# EAGLE design RHD2132_lvds_headstage_3_1_smaller_01 (EAGLE 6.3)
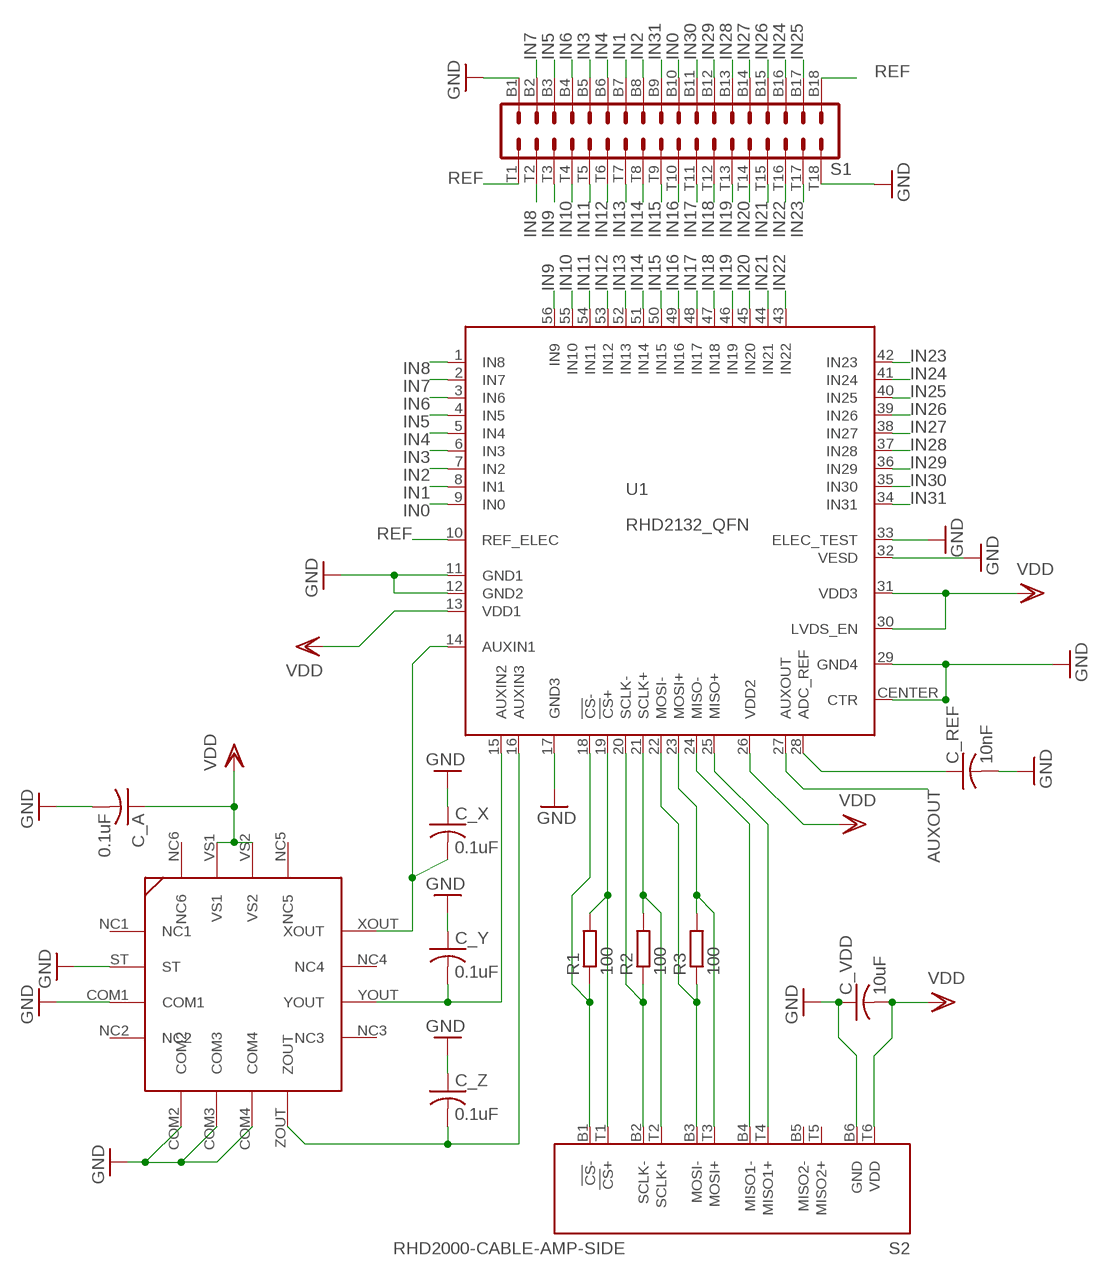
[diagram p0: schematic, sheet 1]

## Parts
C_A  0.1uF  C-USC0402K  [C0402K]
C_REF  10nF  C-USC0402K  [C0402K]
C_VDD  10uF  C-USC0402K  [C0402K]
C_X  0.1uF  C-USC0402K  [C0402K]
C_Y  0.1uF  C-USC0402K  [C0402K]
C_Z  0.1uF  C-USC0402K  [C0402K]
R1  100  R-EU_R0402  [R0402]
R2  100  R-EU_R0402  [R0402]
R3  100  R-EU_R0402  [R0402]
S1  OMNETICS_A79025  [OMNETICS_A79025]
S2  RHD2000-CABLE-AMP-SIDE  [OMNETICS_PZN-12-AA]
U1  RHD2132_QFN  [QFN56_8_X_8_LARGE]
U$1  ADXL335  [ADXL335]

## Nets
ADC_REF: C_REF.1 U1.28(ADC_REF)
AUXOUT: U1.27(AUXOUT)
CS+: R1.2 S2.T1(!CS!+) U1.19(!CS!+)
CS-: R1.1 S2.B1(!CS!-) U1.18(!CS!-)
GND: C_A.2 C_REF.2 C_VDD.1 C_X.1 C_Y.1 C_Z.1 S1.B1 S1.T18 S2.B6(GND) U1.11(GND1) U1.12(GND2) U1.17(GND3) U1.29(GND4) U1.32(VESD) U1.33(ELEC_TEST) U1.CENTER(CTR) U$1.COM1 U$1.COM2 U$1.COM3 U$1.COM4 U$1.ST
IN0: S1.B10 U1.9(IN0)
IN1: S1.B7 U1.8(IN1)
IN2: S1.B8 U1.7(IN2)
IN3: S1.B5 U1.6(IN3)
IN4: S1.B6 U1.5(IN4)
IN5: S1.B3 U1.4(IN5)
IN6: S1.B4 U1.3(IN6)
IN7: S1.B2 U1.2(IN7)
IN8: S1.T2 U1.1(IN8)
IN9: S1.T3 U1.56(IN9)
IN10: S1.T4 U1.55(IN10)
IN11: S1.T5 U1.54(IN11)
IN12: S1.T6 U1.53(IN12)
IN13: S1.T7 U1.52(IN13)
IN14: S1.T8 U1.51(IN14)
IN15: S1.T9 U1.50(IN15)
IN16: S1.T10 U1.49(IN16)
IN17: S1.T11 U1.48(IN17)
IN18: S1.T12 U1.47(IN18)
IN19: S1.T13 U1.46(IN19)
IN20: S1.T14 U1.45(IN20)
IN21: S1.T15 U1.44(IN21)
IN22: S1.T16 U1.43(IN22)
IN23: S1.T17 U1.42(IN23)
IN24: S1.B16 U1.41(IN24)
IN25: S1.B17 U1.40(IN25)
IN26: S1.B15 U1.39(IN26)
IN27: S1.B14 U1.38(IN27)
IN28: S1.B13 U1.37(IN28)
IN29: S1.B12 U1.36(IN29)
IN30: S1.B11 U1.35(IN30)
IN31: S1.B9 U1.34(IN31)
MISO1+: S2.T4(MISO1+) U1.25(MISO+)
MISO1-: S2.B4(MISO1-) U1.24(MISO-)
MOSI+: R3.2 S2.T3(MOSI+) U1.23(MOSI+)
MOSI-: R3.1 S2.B3(MOSI-) U1.22(MOSI-)
REF: S1.B18 S1.T1 U1.10(REF_ELEC)
SCLK+: R2.2 S2.T2(SCLK+) U1.21(SCLK+)
SCLK-: R2.1 S2.B2(SCLK-) U1.20(SCLK-)
VDD: C_A.1 C_VDD.2 S2.T6(VDD) U1.13(VDD1) U1.26(VDD2) U1.30(LVDS_EN) U1.31(VDD3) U$1.VS1 U$1.VS2
XOUT: C_X.2 U1.14(AUXIN1) U$1.XOUT
YOUT: C_Y.2 U1.15(AUXIN2) U$1.YOUT
ZOUT: C_Z.2 U1.16(AUXIN3) U$1.ZOUT
Unconnected: S2.B5(MISO2-) S2.T5(MISO2+) U$1.NC1 U$1.NC2 U$1.NC3 U$1.NC4 U$1.NC5 U$1.NC6

## Library data of the parts
C_A C_REF C_VDD C_X C_Y C_Z = resistor:C-US: CAPACITOR, American symbol
R1-R3 = resistor:R-EU_: RESISTOR, European symbol
S1 = RHD2000:OMNETICS_A79025
S2 = RHD2000:RHD2000-CABLE-AMP-SIDE
U1 = RHD2000:RHD2132
U$1 = voigts:ADXL335: The ADXL335 is a small, thin, low power, complete 3-axis accelerometer with signal conditioned voltage outputs. The product measures acceleration with a minimum full-scale range of ±3 g. It can measure the static acceleration of gravity in tilt-sensing applications, as well as dynamic acceleration resulting from motion, shock, or vibration. The user selects the bandwidth of the accelerometer using the CX, CY, and CZ capacitors at the XOUT, YOUT, and ZOUT pins. Bandwidths can be selected to suit the application, with a range of 0.5 Hz to 1600 Hz for the X and Y axes, and a range of 0.5 Hz to 550 Hz for the Z axi

## Board
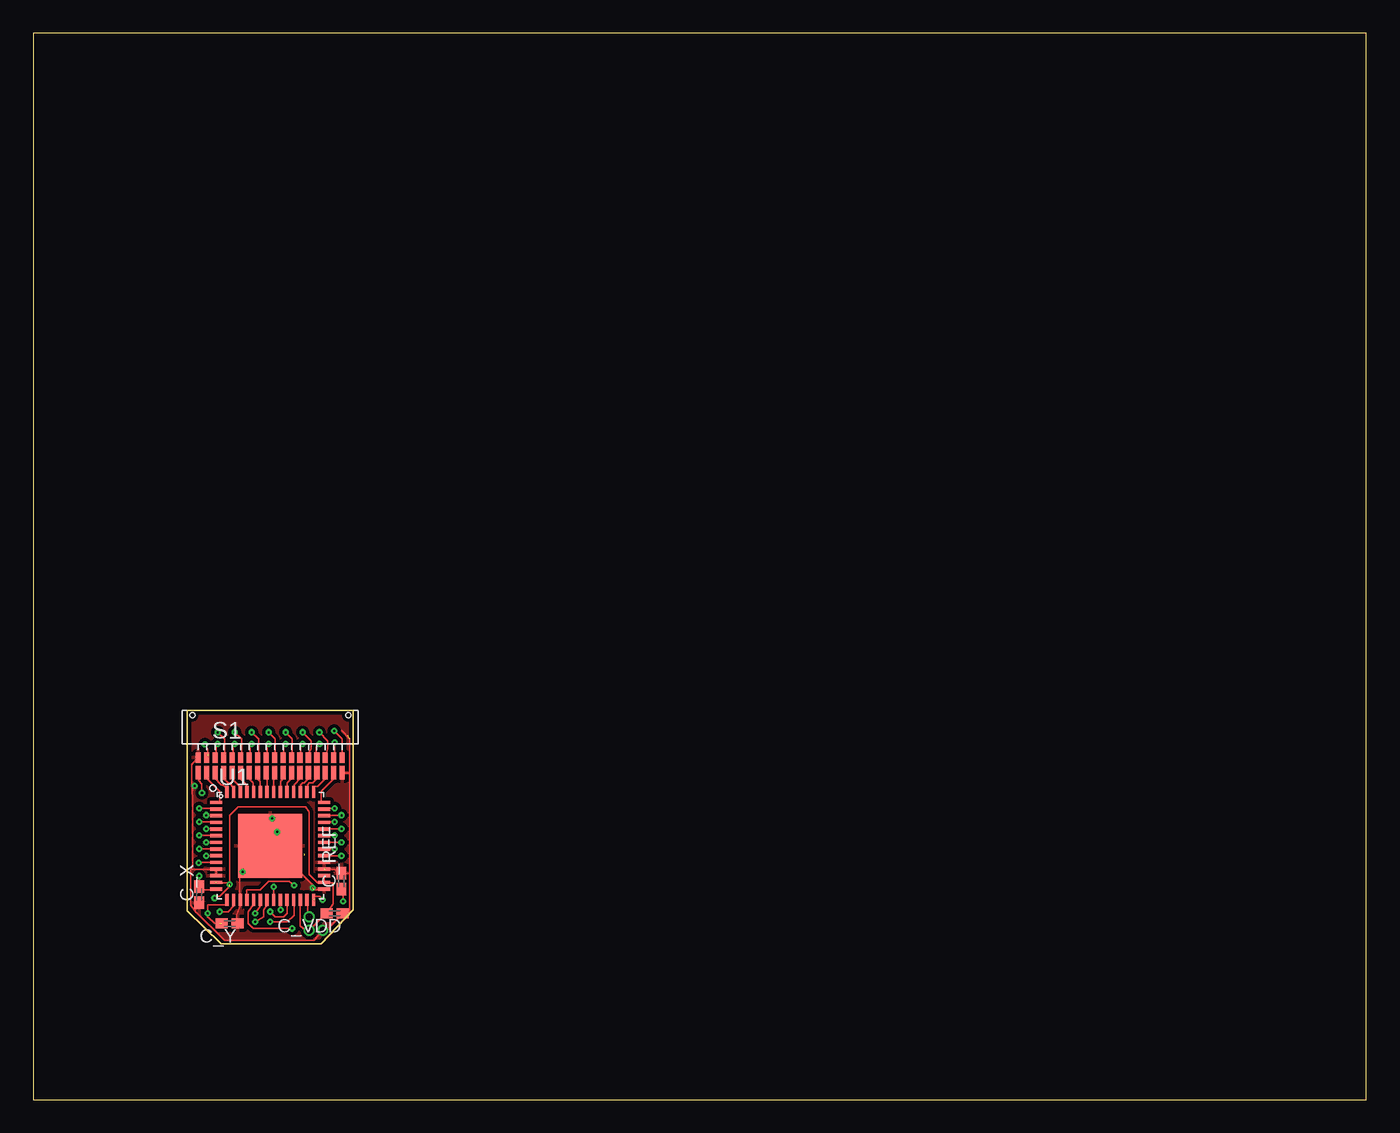
[diagram p1: board, top side]
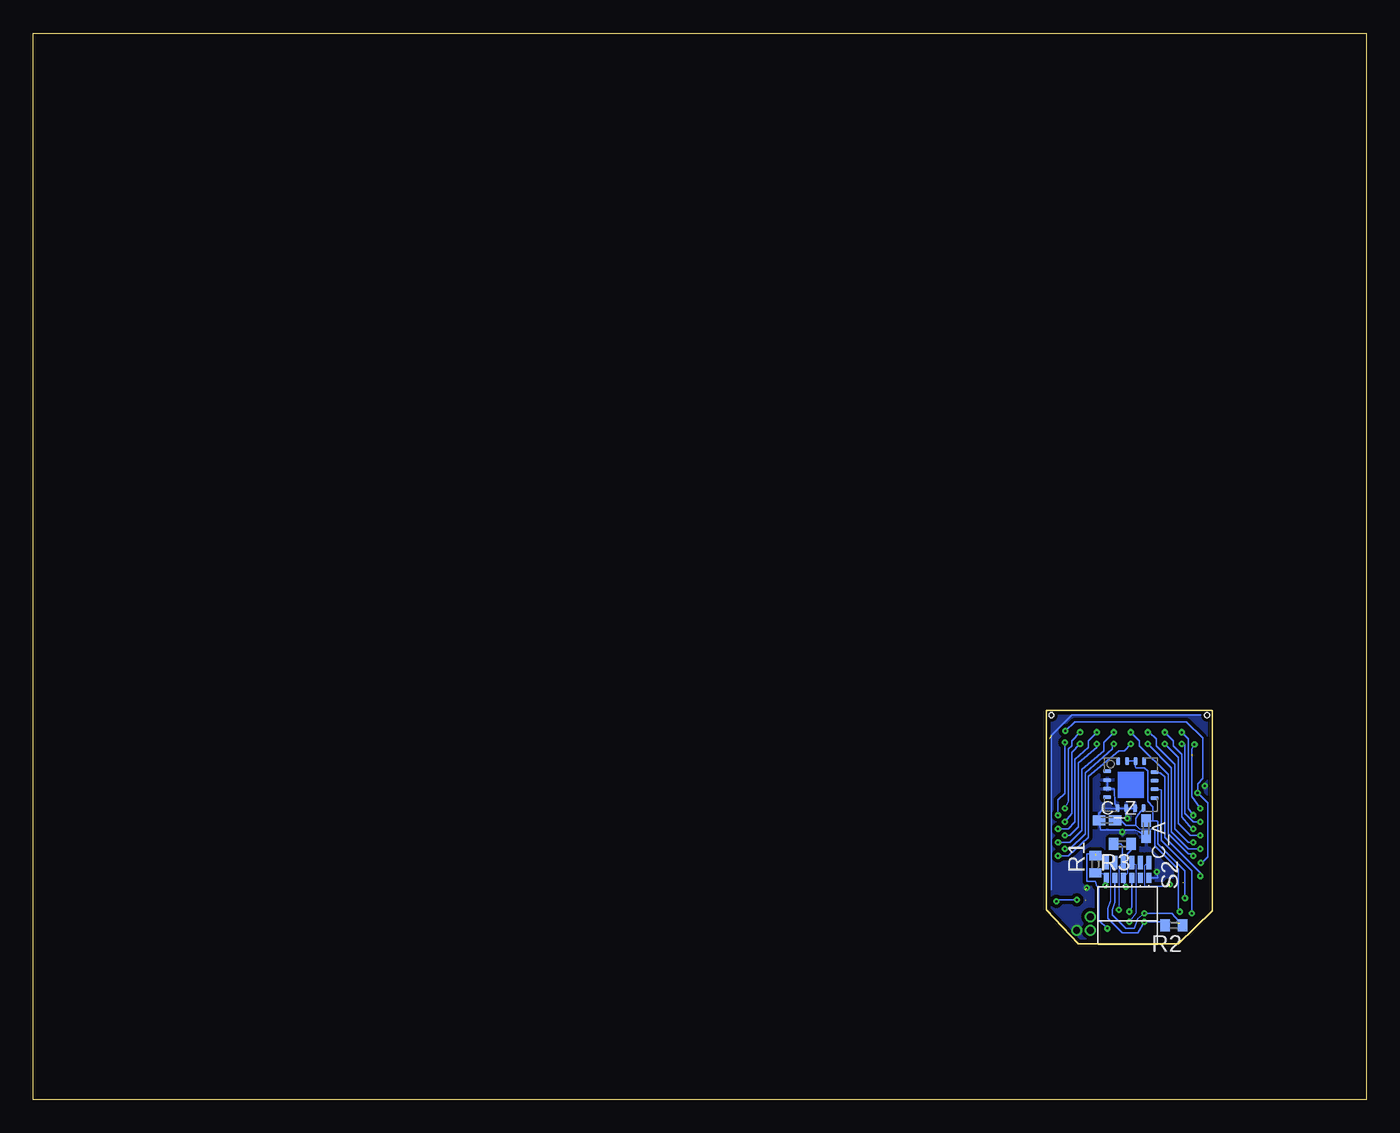
[diagram p2: board, bottom side, seen from below]

Size 100 x 80 mm. Coordinates in mm from the lower left corner, seen from the top.
Outline: 0,0 100,0 100,80 0,80 0,0
Outline: 11.56,29.21 11.56,14.16 14.1,11.68 21.59,11.68 24,14.22 24,29.21 11.56,29.21
Copper layers (1*16): Top 0.0178mm / dielectric 59mil / Bottom 0.0178mm
Design rules "default": minimum track width 5mil, minimum drill 10mil, track to track 5mil, track to pad 5mil, pad to pad 5mil, via to via 5mil, smd to smd 5mil, copper to edge 10mil, drill to drill 16mil, minimum pad ring 6mil, minimum via ring 6mil, stop-mask expansion 3mil, vias tented up to drill 0mil, thermal gap 10mil
Holes 0.38 mm at 11.94,28.83 23.62,28.83

### Footprints (pad centres in the part's own frame; a part is rotated, then mirrored left to right if it is on the bottom)
C0402K = smd 0.925 x 0.74: 1 -0.6,0; 2 0.6,0
R0402 = smd 0.7 x 0.9: 1 -0.65,0; 2 0.65,0
OMNETICS_A79025 = smd 0.381 x 0.762: B1 -5.397,-1.016; B2 -4.763,-1.016; B3 -4.128,-1.016; B4 -3.493,-1.016; B5 -2.857,-1.016; B6 -2.223,-1.016; B7 -1.587,-1.016; B8 -0.953,-1.016; B9 -0.318,-1.016; B10 0.318,-1.016; B11 0.953,-1.016; B12 1.587,-1.016; B13 2.223,-1.016; B14 2.857,-1.016; B15 3.493,-1.016; B16 4.128,-1.016; B17 4.763,-1.016; B18 5.397,-1.016 | smd 0.381 x 1.016: T1 -5.397,-2.159; T2 -4.763,-2.159; T3 -4.128,-2.159; T4 -3.493,-2.159; T5 -2.857,-2.159; T6 -2.223,-2.159; T7 -1.587,-2.159; T8 -0.953,-2.159; T9 -0.318,-2.159; T10 0.318,-2.159; T11 0.953,-2.159; T12 1.587,-2.159; T13 2.223,-2.159; T14 2.857,-2.159; T15 3.493,-2.159; T16 4.128,-2.159; T17 4.763,-2.159; T18 5.397,-2.159
OMNETICS_PZN-12-AA = smd 0.381 x 0.762: B1 1.587,-1.016; B2 0.953,-1.016; B3 0.318,-1.016; B4 -0.318,-1.016; B5 -0.953,-1.016; B6 -1.587,-1.016 | smd 0.381 x 1.016: T1 1.587,-2.159; T2 0.953,-2.159; T3 0.318,-2.159; T4 -0.318,-2.159; T5 -0.953,-2.159; T6 -1.587,-2.159
QFN56_8_X_8_LARGE = smd 0.9 x 0.25: 1 -4.05,3.25; 2 -4.05,2.75; 3 -4.05,2.25; 4 -4.05,1.75; 5 -4.05,1.25; 6 -4.05,0.75; 7 -4.05,0.25; 8 -4.05,-0.25; 9 -4.05,-0.75; 10 -4.05,-1.25; 11 -4.05,-1.75; 12 -4.05,-2.25; 13 -4.05,-2.75; 14 -4.05,-3.25; 29 4.05,-3.25; 30 4.05,-2.75; 31 4.05,-2.25; 32 4.05,-1.75; 33 4.05,-1.25; 34 4.05,-0.75; 35 4.05,-0.25; 36 4.05,0.25; 37 4.05,0.75; 38 4.05,1.25; 39 4.05,1.75; 40 4.05,2.25; 41 4.05,2.75; 42 4.05,3.25 | smd 0.25 x 0.9: 15 -3.25,-4.05; 16 -2.75,-4.05; 17 -2.25,-4.05; 18 -1.75,-4.05; 19 -1.25,-4.05; 20 -0.75,-4.05; 21 -0.25,-4.05; 22 0.25,-4.05; 23 0.75,-4.05; 24 1.25,-4.05; 25 1.75,-4.05; 26 2.25,-4.05; 27 2.75,-4.05; 28 3.25,-4.05; 43 3.25,4.05; 44 2.75,4.05; 45 2.25,4.05; 46 1.75,4.05; 47 1.25,4.05; 48 0.75,4.05; 49 0.25,4.05; 50 -0.25,4.05; 51 -0.75,4.05; 52 -1.25,4.05; 53 -1.75,4.05; 54 -2.25,4.05; 55 -2.75,4.05; 56 -3.25,4.05 | smd 4.8 x 4.8: CENTER 0,0
ADXL335 = smd 0.61 x 0.305: COM1 -1.775,-0.3; NC1 -1.775,1; NC2 -1.775,-0.95; NC3 1.775,-1; NC4 1.775,0.3; ST -1.775,0.35; XOUT 1.775,0.95; YOUT 1.775,-0.35 | smd 0.305 x 0.61: COM2 -1,-1.775; COM3 -0.35,-1.775; COM4 0.3,-1.775; NC5 1,1.775; NC6 -0.95,1.775; VS1 0.35,1.775; VS2 -0.3,1.775; ZOUT 0.95,-1.775

### Placement (x,y rotation side)
C_A  16.51,20.32 270 bottom
C_REF  23.11,16.38 90 top
C_VDD  22.61,13.97 180 top
C_X  12.45,15.37 90 top
C_Y  14.73,13.21 180 top
C_Z  19.43,20.95 0 bottom
R1  20.32,17.65 90 bottom
R2  14.43,13.08 180 bottom
R3  18.29,19.18 180 bottom
S1  17.78,26.67 0 top
S2  17.91,15.62 180 bottom
U1  17.78,19.05 0 top
U$1  17.65,23.62 0 bottom

### Tracks (layer width: path | path; a pad name or v marks a point on that pad's centre or on a via)
ADC_REF  (via drill 0.15)  (1 unrouted)
  Top 0.127: C_REF.1 23.28,15.78 23.11,15.75 23.37,15.75 23.24,15.62 v23.24,14.86 | 21.08,14.99 21.08,15.24 21.46,15.24 v21.72,14.99
  Bottom 0.127: v21.72,14.99 23.11,14.99 v23.24,14.86
AUXOUT  (via drill 0.51)
  Top 0.127: v20.7,13.72 20.57,13.72 20.57,14.61 20.53,14.65 U1.27
CS+  (via drill 0.15 pad 0.25)  (1 unrouted)
  Top 0.127: v19.43,12.83 16.51,12.83 16.13,13.21 16.13,14.1 16.51,14.61 16.51,14.98 U1.19
  Bottom 0.127: S2.T1 20.32,18.41 20.95,18.41 20.95,16.38 20.32,16.38 20.19,16 20.07,16 20.07,13.46 v19.43,12.83
CS-  (via drill 0.15)
  Top 0.076: 16,14.97 U1.18
  Top 0.127: v19.56,16.08 19.18,16.38 17.65,16.38 17.02,15.75 16,15.75 16,14.97
  Bottom 0.076: 19.51,16.88 S2.B1
  Bottom 0.127: 19.56,16.57 S2.B1 19.49,15.94 v19.56,16.08 19.43,16 | R1.1 19.51,16.88
GND  (via drill 0.15, 0.51)  (3 unrouted)
  Top 0.076: v21.72,12.7 22.23,12.95 23.11,13.84
  Top 0.127: 22.1,15.75 21.08,15.75 21.08,16 19.81,17.27 19.68,17.14 | 15.49,16.76 15.75,16.76 v15.71,17.09 | v15.71,17.09 16.26,17.27 16,17.27 17.78,18.54 | v15.71,17.09 15.62,16.89 | 15.62,16.89 15.49,16.76 | 15.24,13.21 15.24,13.84 15.53,14.51 U1.17 15.53,15.2 15.49,15.24 15.49,16.76 | 22.23,12.95 23.08,13.81 C_VDD.1 23.21,13.84 23.5,13.84 23.75,14.1 23.75,17.02 | 23.75,17.02 23.33,16.89 C_REF.2 22.89,16.98 22.61,17.27 21.84,17.27 | 23.75,24.51 23.75,17.02 | 11.91,23.16 11.94,22.61 11.94,17.65 11.81,17.14 | C_X.1 12.16,14.13 | 12.16,14.13 11.81,14.61 11.81,17.14 | v21.72,12.7 21.08,11.94 14.35,11.94 12.16,14.13 | 23.11,24.51 23.75,24.51 | 15.75,17.02 15.62,16.89 | 23.75,24.51 23.75,27.05 23.11,27.69 | U1.12 13.72,16.8 13.72,17.27 11.81,17.27 11.81,17.14 | 11.91,23.16 11.91,23.37 11.89,23.47 11.89,25.16 S1.B1 | 11.91,23.16 12.12,23.5 v12.12,23.52
  Bottom 0.127: 12.42,28.85 22.07,28.85 23.62,27.3 23.62,15.75 | U$1.COM4 U$1.COM3 | U$1.COM3 U$1.COM2 18.62,21.81 | U$1.COM3 18.03,21.21 v17.91,21.08 | U$1.ST U$1.COM1 18.88,23.32 18.87,22.2 18.62,21.81 | 18.62,21.81 19.67,21.86 20.07,21.46 20.07,20.95 | C_A.2 17.02,20.07 17.36,20.23 19.94,20.23 C_Z.1 | S2.B6 15.62,16.64 v15.71,17.09
  other vias: 20.95,15.88 18.29,20.07
  pour Top (isolate 0.254): 11.3,29.21 11.3,10.98 14.86,7.49 21.21,7.24 24.26,10.92 24.26,29.21
  pour Bottom (isolate 0.254): 11.18,29.21 11.18,10.86 14.61,7.11 21.46,7.11 24.64,10.41 24.26,29.21
IN0  (via drill 0.15)
  Top 0.127: v17.65,27.56 18.16,27.05 18.16,25.91 18.1,25.84 S1.B10 | v12.95,18.29 13.72,18.29 U1.9
  Bottom 0.127: v17.65,27.56 17.02,26.92 17.02,26.54 14.86,24.38 14.86,19.94 13.34,18.41 12.95,18.41 v12.95,18.29
IN1  (via drill 0.15)
  Top 0.127: v16.38,26.67 16.26,26.54 16.26,25.91 16.19,25.84 S1.B7 | v12.45,18.8 U1.8
  Bottom 0.127: v16.38,26.67 14.61,24.89 14.61,20.07 13.34,18.8 v12.45,18.8
IN2  (via drill 0.15, 0.15 pad 0.15)
  Top 0.127: v12.95,19.3 U1.7 | v16.38,27.56 16.89,27.05 16.89,25.91 16.83,25.84 S1.B8
  Bottom 0.127: v16.38,27.56 16.26,27.56 15.75,27.05 15.75,26.54 14.35,25.15 14.35,20.32 13.34,19.3 v12.95,19.3
IN3  (via drill 0.15, 0.15 pad 0.15)
  Top 0.127: v12.45,19.81 13.34,19.81 13.35,19.8 U1.6 | v15.11,26.67 14.99,26.54 14.99,25.91 14.92,25.84 S1.B5
  Bottom 0.127: v12.45,19.81 13.21,19.81 14.1,20.7 14.1,25.65 v15.11,26.67
IN4  (via drill 0.15)
  Top 0.127: v12.95,20.32 13.34,20.32 13.36,20.3 U1.5 | v15.11,27.56 15.62,27.05 15.62,25.91 15.56,25.84 S1.B6
  Bottom 0.127: v15.11,27.56 14.48,26.92 14.48,26.54 13.84,25.91 13.84,21.21 13.08,20.32 v12.95,20.32
IN5  (via drill 0.15)
  Top 0.127: v12.45,20.83 13.59,20.83 13.62,20.8 U1.4 | v13.84,26.67 13.84,26.54 13.72,26.42 13.72,25.72 S1.B3
  Bottom 0.127: v12.45,20.83 12.95,20.83 13.59,21.46 13.59,26.67 v13.84,26.67
IN6  (via drill 0.15)
  Top 0.127: v13.84,27.56 14.35,27.05 14.35,25.91 14.29,25.84 S1.B4 | v12.95,21.34 13.46,21.34 13.5,21.3 U1.3
  Bottom 0.127: v13.84,27.56 13.34,27.05 13.34,21.84 v12.95,21.34
IN7  (via drill 0.15)  (1 unrouted)
  Top 0.127: 13.08,25.91 13.08,26.29 v12.88,26.64 | v12.45,21.84 13.69,21.84 U1.2 | S1.B2 13.02,25.72 13.08,25.78
  Bottom 0.127: v12.88,26.64 13.08,26.29 13.08,22.73 v12.45,21.84
IN8
  Top 0.127: S1.T2 13.02,24.19 12.95,24.13 13.97,23.11 13.97,22.35 13.92,22.3 U1.1
IN9
  Top 0.127: S1.T3 13.65,24.19 13.59,24.13 14.1,23.62 14.22,23.62 14.35,23.5 14.48,23.5 14.48,23.15 U1.56
IN10
  Top 0.127: S1.T4 14.29,24.19 14.22,24.13 14.61,23.75 14.73,23.75 14.86,23.62 14.99,23.37 14.99,23.14 U1.55
IN11
  Top 0.127: S1.T5 14.92,24.19 14.86,24.13 15.49,23.5 15.49,23.14 U1.54
IN12
  Top 0.127: S1.T6 15.56,24.19 15.49,24.13 16,23.62 16,23.13 U1.53
IN13
  Top 0.127: S1.T7 16.19,24.19 16.13,24.13 16.51,23.75 16.51,23.12 U1.52
IN14
  Top 0.127: S1.T8 16.83,24.19 16.76,24.13 17.02,23.88 17.02,23.11 U1.51
IN15
  Top 0.127: S1.T9 17.46,24.19 17.53,24.13 U1.50
IN16
  Top 0.127: S1.T10 18.1,24.19 18.03,24.13 U1.49
IN17
  Top 0.127: S1.T11 18.73,24.19 18.8,24.13 18.54,23.88 18.54,23.11 U1.48
IN18
  Top 0.127: S1.T12 19.37,24.19 19.43,24.13 19.05,23.75 19.05,23.12 U1.47
IN19
  Top 0.127: S1.T13 20,24.19 20.07,24.13 19.56,23.62 19.56,23.13 U1.46
IN20
  Top 0.127: U1.45 20.07,23.14 20.07,23.62 20.19,23.75 20.32,23.75 20.7,24.13 20.64,24.19 S1.T14
IN21
  Top 0.127: U1.44 20.53,23.32 20.57,23.37 20.57,23.62 20.7,23.75 20.95,23.75 21.34,24.13 21.34,24.45 S1.T15
IN22
  Top 0.127: U1.43 21.03,23.44 21.08,23.5 21.34,23.5 21.97,24.13 21.91,24.19 S1.T16
IN23
  Top 0.127: U1.42 21.64,22.3 21.59,22.35 21.59,23.11 22.61,24.13 22.54,24.19 S1.T17
IN24  (via drill 0.15)
  Top 0.127: v22.61,21.84 22.23,21.84 22.18,21.8 U1.41 | v21.46,27.56 22.1,26.92 22.1,26.29 21.97,25.91 21.91,25.84 S1.B16
  Bottom 0.127: v22.61,21.84 22.35,22.35 22.35,26.29 22.1,26.54 22.1,26.92 v21.46,27.56
IN25  (via drill 0.15)
  Top 0.127: v22.61,26.8 22.61,25.72 S1.B17 | v23.11,21.34 22.23,21.34 22.19,21.3 U1.40
  Bottom 0.127: v22.61,26.8 22.61,22.99 23.11,22.48 v23.11,21.34
IN26  (via drill 0.15)
  Top 0.127: v22.61,20.83 21.86,20.83 U1.39 | v21.46,26.67 21.21,26.42 21.21,25.91 21.27,25.84 S1.B15
  Bottom 0.127: v22.61,20.83 22.1,21.46 22.1,26.04 v21.46,26.67
IN27  (via drill 0.15)
  Top 0.127: v20.19,27.56 20.83,26.92 20.83,26.29 20.57,25.91 20.64,25.84 S1.B14 | v23.11,20.32 21.85,20.32 U1.38
  Bottom 0.127: v20.19,27.56 20.83,26.92 20.83,26.42 21.84,25.53 21.84,20.83 22.35,20.32 v23.11,20.32
IN28  (via drill 0.15)
  Top 0.127: v22.61,19.81 21.84,19.81 U1.37 | v20.19,26.67 20.07,26.54 20.07,25.91 20,25.84 S1.B13
  Bottom 0.127: v20.19,26.67 20.19,26.42 21.59,25.27 21.59,20.45 22.23,19.81 v22.61,19.81
IN29  (via drill 0.15)
  Top 0.127: v23.11,19.3 U1.36 | v18.92,27.56 19.43,27.05 19.43,25.91 19.37,25.84 S1.B12
  Bottom 0.127: v23.11,19.3 22.23,19.3 21.34,20.19 21.34,24.77 19.68,26.16 19.68,26.8 v18.92,27.56
IN30  (via drill 0.15)
  Top 0.127: v22.61,18.8 U1.35 | v18.92,26.67 18.8,26.54 18.8,25.91 18.73,25.84 S1.B11
  Bottom 0.127: v22.61,18.8 22.23,18.8 21.08,19.94 21.08,24.51 19.05,26.29 19.05,26.54 v18.92,26.67
IN31  (via drill 0.15)
  Top 0.127: v17.65,26.67 17.53,26.54 17.53,25.91 17.46,25.84 S1.B9 | v23.11,18.29 22.1,18.29 22.09,18.3 U1.34
  Bottom 0.127: v17.65,26.67 18.16,26.16 18.54,26.16 20.83,24.26 20.83,19.68 22.35,18.29 v23.11,18.29
MISO1+  (via drill 0.15)
  Top 0.076: 19.56,14.61 U1.25
  Top 0.127: v17.78,13.34 19.04,13.34 19.56,13.83 19.56,14.61
  Bottom 0.076: S2.T4 17.53,17.78 17.27,17.65 17.27,13.97 v17.78,13.34
MISO1-  (via drill 0.15)
  Top 0.127: v17.78,14.1 18.16,13.72 18.8,13.72 19.05,13.97 19.05,14.35 U1.24
  Bottom 0.127: S2.B4 17.59,14.41 v17.78,14.1
MOSI+  (via drill 0.15)
  Top 0.076: v18.54,14.22 18.54,14.86
  Top 0.127: 18.54,14.86 18.54,14.99 U1.23
  Bottom 0.076: 18.16,17.65 18.41,17.65 18.54,17.53 v18.54,14.22 | 18.29,17.84 S2.T3
  Bottom 0.127: S2.T3 18.16,17.65 | R3.2 18.41,19.18 18.29,19.05 18.29,17.84
MOSI-  (via drill 0.15)
  Top 0.076: 18.03,14.94 18.03,14.86
  Top 0.127: v18.03,15.95 18.03,14.94 U1.22
  Bottom 0.076: R3.1 17.64,18.68 | 17.91,18.41 17.91,16.95 S2.B3
  Bottom 0.127: S2.B3 18.29,16.57 v18.03,15.95 | 17.64,18.68 17.91,18.41
REF  (via drill 0.15)
  Top 0.127: U1.10 12.47,17.8 v12.42,17.75 | v12.65,23.01 12.65,23.7 12.42,23.93 12.42,24.47 S1.T1 | S1.B18 23.18,27.04 v22.55,27.66
  Bottom 0.127: v12.42,17.75 12.34,17.75 11.89,18.21 11.89,22.25 v12.65,23.01 12.65,23.7 12.27,24.08 12.27,27.13 13.49,28.35 21.87,28.35 v22.55,27.66
SCLK+  (via drill 0.15)
  Top 0.076: 17.53,14.61 U1.21
  Top 0.127: v16.64,13.34 17.27,13.72 17.27,14.22 17.53,14.61
  Bottom 0.076: S2.T2 19.05,17.78 19.18,17.65 19.18,14.86
  Bottom 0.127: 19.18,14.86 19.38,14.35 19.38,13.59 18.29,12.5 17.14,12.5 v16.64,13.34 14.99,13.34 R2.2 14.99,13.08
SCLK-  (via drill 0.15)
  Top 0.127: v16.64,13.97 17.02,14.48 17.02,14.86 17.03,14.87 U1.20
  Bottom 0.076: 17.14,13.59 v16.64,13.97
  Bottom 0.127: S2.B2 18.86,14.8 19.05,14.22 19.05,13.84 18.03,12.83 17.4,12.83 17.14,13.59 | R2.1 14.59,13.98 v16.64,13.97
VDD  (via drill 0.15, 0.15 pad 0.25, 0.51)  (2 unrouted)
  Top 0.127: 13.72,16.26 14.71,16.26 | v13.59,15.11 13.72,15.11 13.84,15.24 13.97,15.24 14.73,16 | U1.26 20.03,13.04 20.45,12.7 v20.7,12.7 21.97,13.97 C_VDD.2 22.48,14.7 22.48,16.26 21.79,16.26 | 21.79,16.26 21.34,16.26 20.7,16.89 20.7,21.59 20.45,21.97 15.37,21.97 14.73,21.34 14.73,16.26 | 21.79,16.26 U1.30 U1.31 | 14.73,16.26 v14.73,16.13 14.73,16.23 14.71,16.26 | 14.71,16.26 14.73,16.26
  Bottom 0.076: 16.32,18.22 16.32,17.84 16.64,17.53 16.64,16
  Bottom 0.127: U$1.VS1 U$1.VS2 17.4,25.4 17.32,25.32 17.32,24.94 17.27,24.89 16.64,24.89 16.38,24.64 16.38,22.35 16,21.97 16,20.95 C_A.1 15.71,20.92 15.62,20.83 15.62,19.18 13.59,17.14 v13.59,15.11 | S2.T6 16.32,18.22 | 16.64,16 14.99,16 v14.73,16.13
XOUT  (via drill 0.15)
  Top 0.127: 14.1,15.75 13.64,15.75 | 13.64,15.75 12.45,15.75 C_X.2 12.45,16.23 v12.45,16.76 | U1.14 13.69,15.8 13.64,15.75
  Bottom 0.127: U$1.XOUT 15.75,24.51 15.43,24.51 15.11,24.19 15.11,19.68 12.45,17.02 v12.45,16.76
YOUT  (via drill 0.15)  (1 unrouted)
  Top 0.127: 13.97,13.21 13.59,13.21 13.08,13.72 v13.08,13.97 13.08,14.61 14.48,14.61 14.53,14.66 U1.15
  Bottom 0.127: U$1.YOUT 15.37,23.24 15.37,19.43 13.08,17.14 v13.08,13.97
ZOUT  (via drill 0.15)
  Top 0.127: U1.16 15.03,14.52 14.61,14.1 v13.97,14.1
  Bottom 0.076: 17.27,20.57 17.02,20.32 16,20.32 15.88,20.19 | 14.1,14.35 v13.97,14.1
  Bottom 0.127: U$1.ZOUT 17.08,21.4 17.27,21.08 17.27,20.57 18.03,20.57 18.45,20.99 C_Z.2 | 15.88,20.19 15.88,19.05 14.1,17.27 14.1,14.35

### Text on the board
tDocu: open-ephys | .org
bDocu: intan | powered by | 32ch headstage | rev 2.1 omnetics